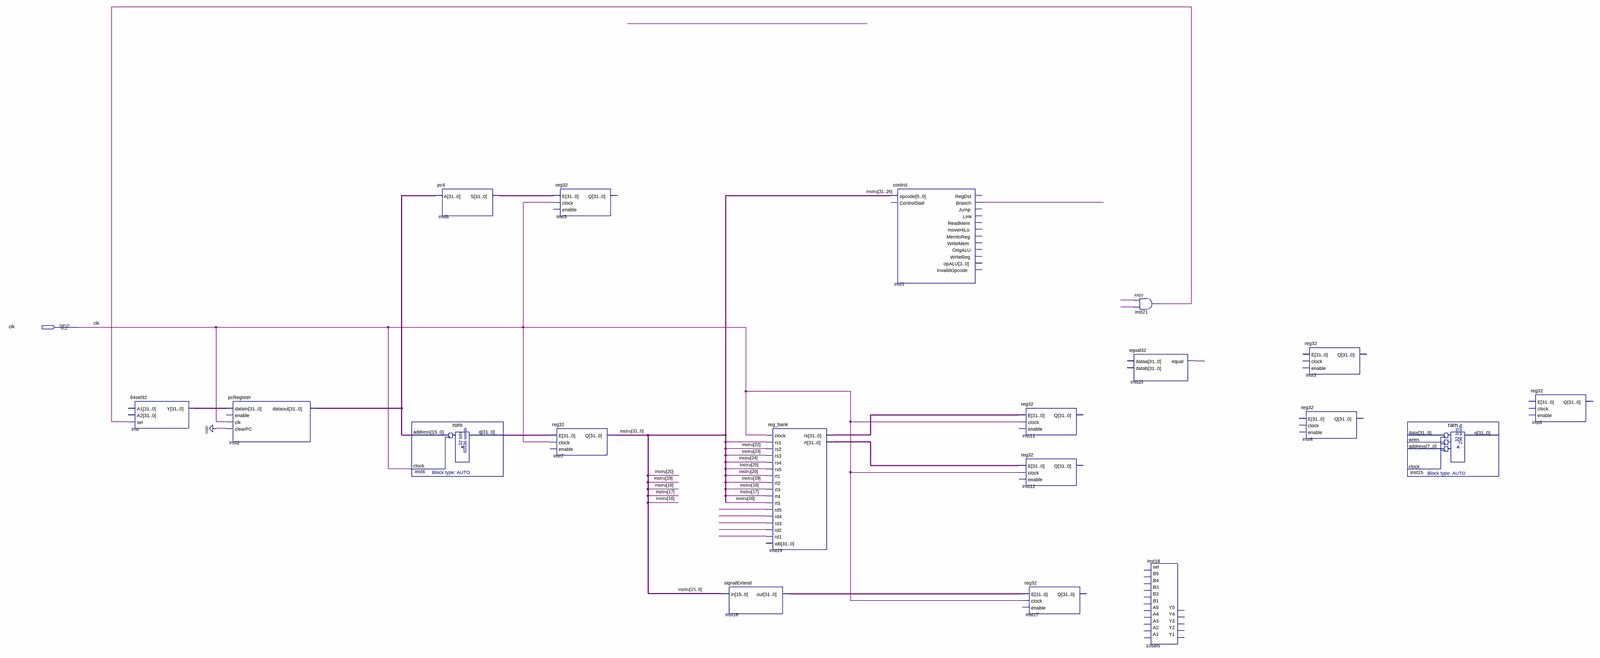
[diagram p0: schematic sheet, whole]
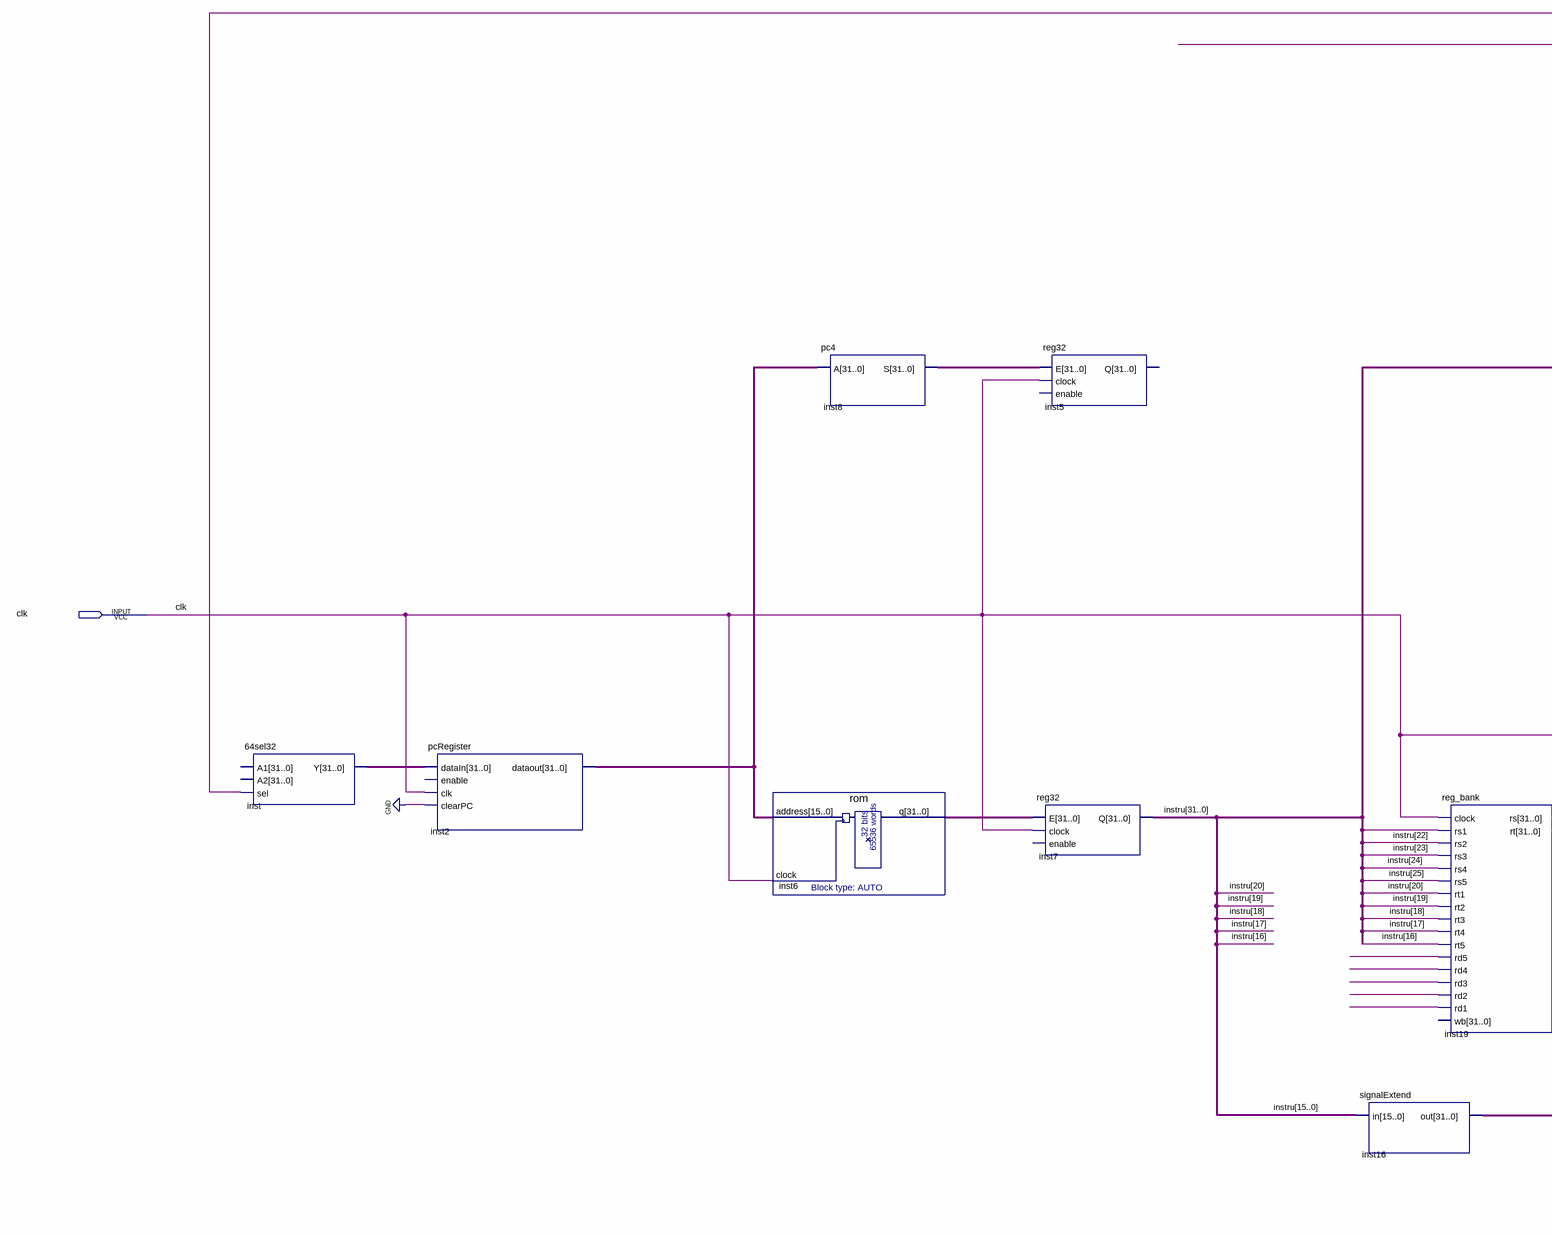
[diagram p1: schematic sheet, left part]
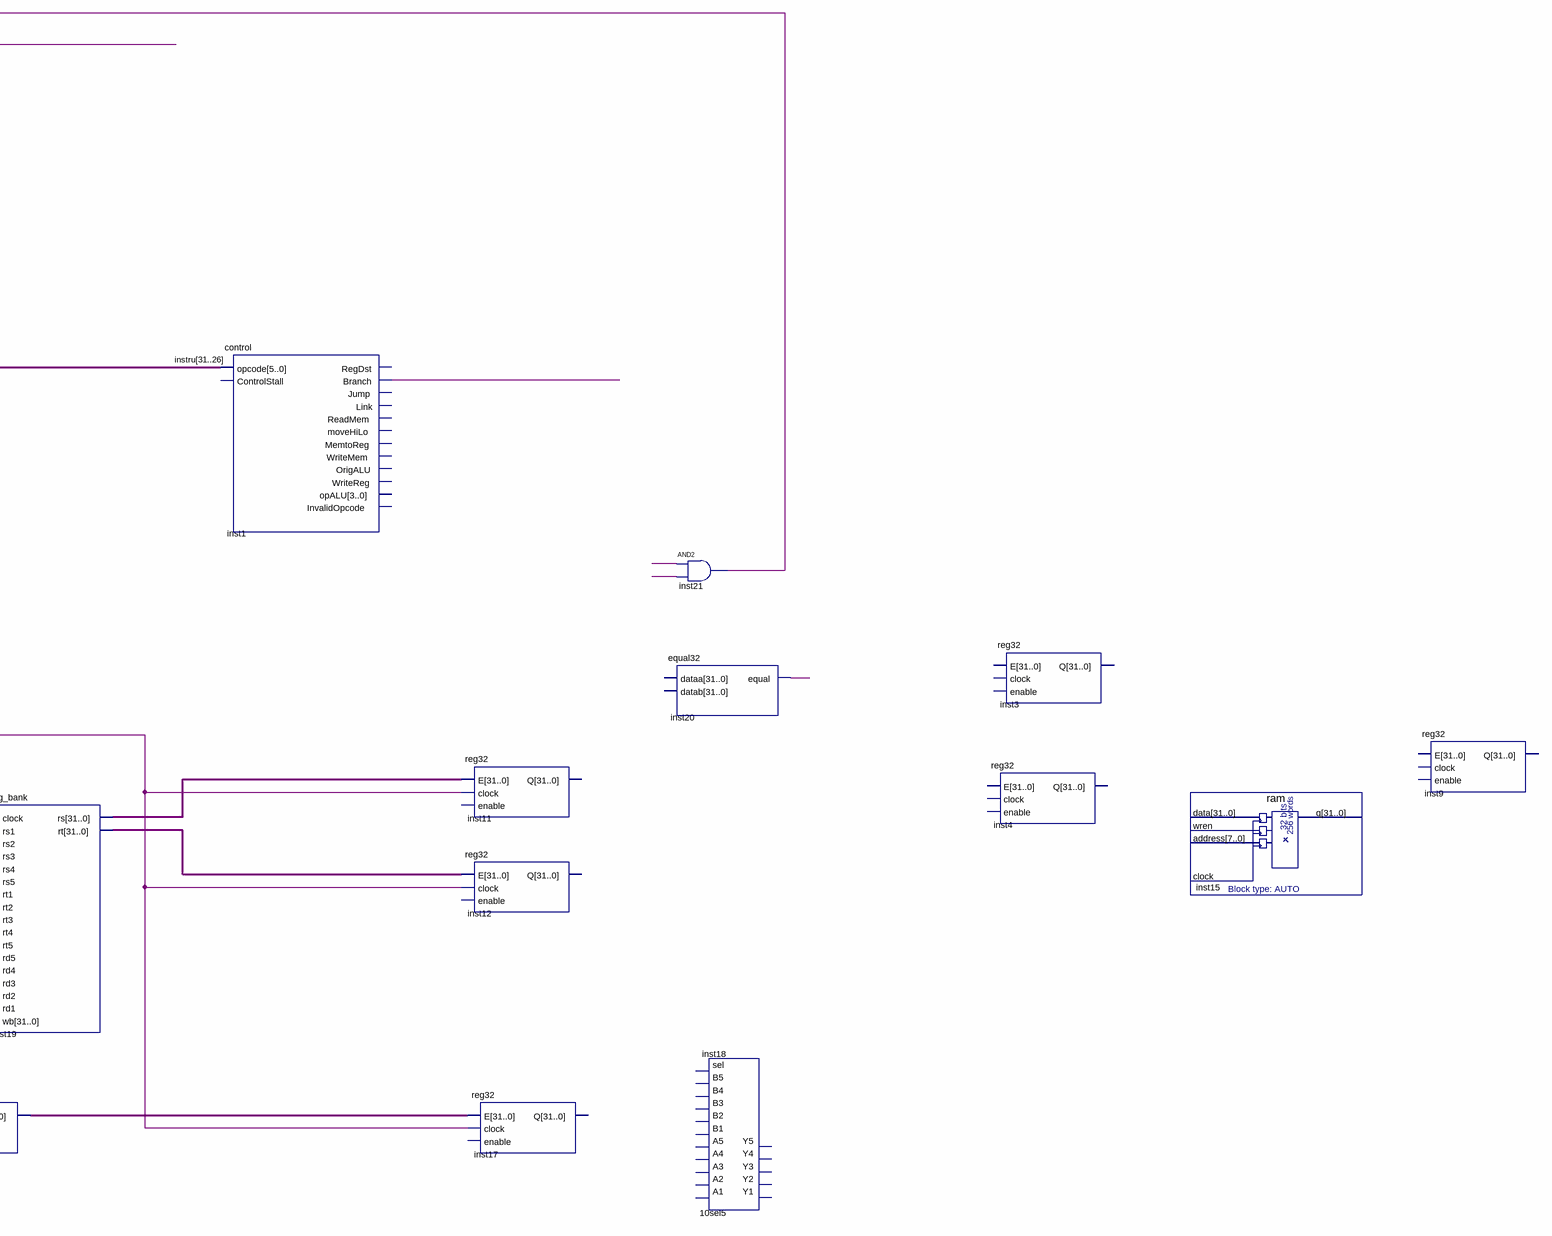
[diagram p2: schematic sheet, right part]
// Quartus schematic Trabalho2.bdf as structural Verilog: 19 symbols, 1 pins
module Trabalho2 (
  input  clk
);

  wire inst1_branch, inst20_equal, inst21_out, undriven, undriven_2, undriven_3, undriven_4, undriven_5,
       undriven_6, undriven_7, undriven_8;
  wire [31:0] inst2_dataout, inst6_q, inst8_s, inst16_out, inst19_rs, inst19_rt, inst_y, instru;

  \64sel32  inst (.sel(inst21_out), .Y(inst_y));  // open: A1, A2
  pcRegister inst2 (.dataIn(inst_y), .clk(clk), .clearPC(1'b0), .dataout(inst2_dataout));  // open: enable
  rom inst6 (.address(inst2_dataout), .clock(clk), .q(inst6_q));
  pc4 inst8 (.A(inst2_dataout), .S(inst8_s));
  reg32 inst5 (.E(inst8_s), .clock(clk));  // open: enable, Q
  reg32 inst7 (.E(inst6_q), .clock(clk), .Q(instru));  // open: enable
  signalExtend inst16 (.in(instru[15:0]), .out(inst16_out));
  reg_bank inst19 (
    .clock(clk), .rs1(undriven_6), .rs2(instru[22]), .rs3(instru[23]), .rs4(instru[24]), .rs5(instru[25]),
    .rt1(instru[20]), .rt2(instru[19]), .rt3(instru[18]), .rt4(instru[17]), .rt5(instru[16]), .rd5(undriven),
    .rd4(undriven_2), .rd3(undriven_3), .rd2(undriven_4), .rd1(undriven_5), .rs(inst19_rs), .rt(inst19_rt));  // open: wb
  control inst1 (
    .opcode(instru[31:26]), .Branch(inst1_branch));  // open: ControlStall, RegDst, Jump, Link, ReadMem, moveHiLo, MemtoReg, WriteMem, OrigALU, WriteReg, opALU, InvalidOpcode
  reg32 inst11 (.E(inst19_rs), .clock(clk));  // open: enable, Q
  reg32 inst12 (.E(inst19_rt), .clock(clk));  // open: enable, Q
  reg32 inst17 (.E(inst16_out), .clock(clk));  // open: enable, Q
  and inst21 (inst21_out, undriven_8, undriven_7);
  equal32 inst20 (.equal(inst20_equal));  // open: dataa, datab
  \10sel5  inst18 ();  // open: A1, A2, A3, A4, A5, B1, B2, B3, B4, B5, sel, Y1, Y2, Y3, Y4, Y5
  reg32 inst3 ();  // open: E, clock, enable, Q
  reg32 inst4 ();  // open: E, clock, enable, Q
  ram inst15 ();  // open: data, wren, address, clock, q
  reg32 inst9 ();  // open: E, clock, enable, Q
endmodule
